# Altium schematic sheet supply.SchDoc
size A3
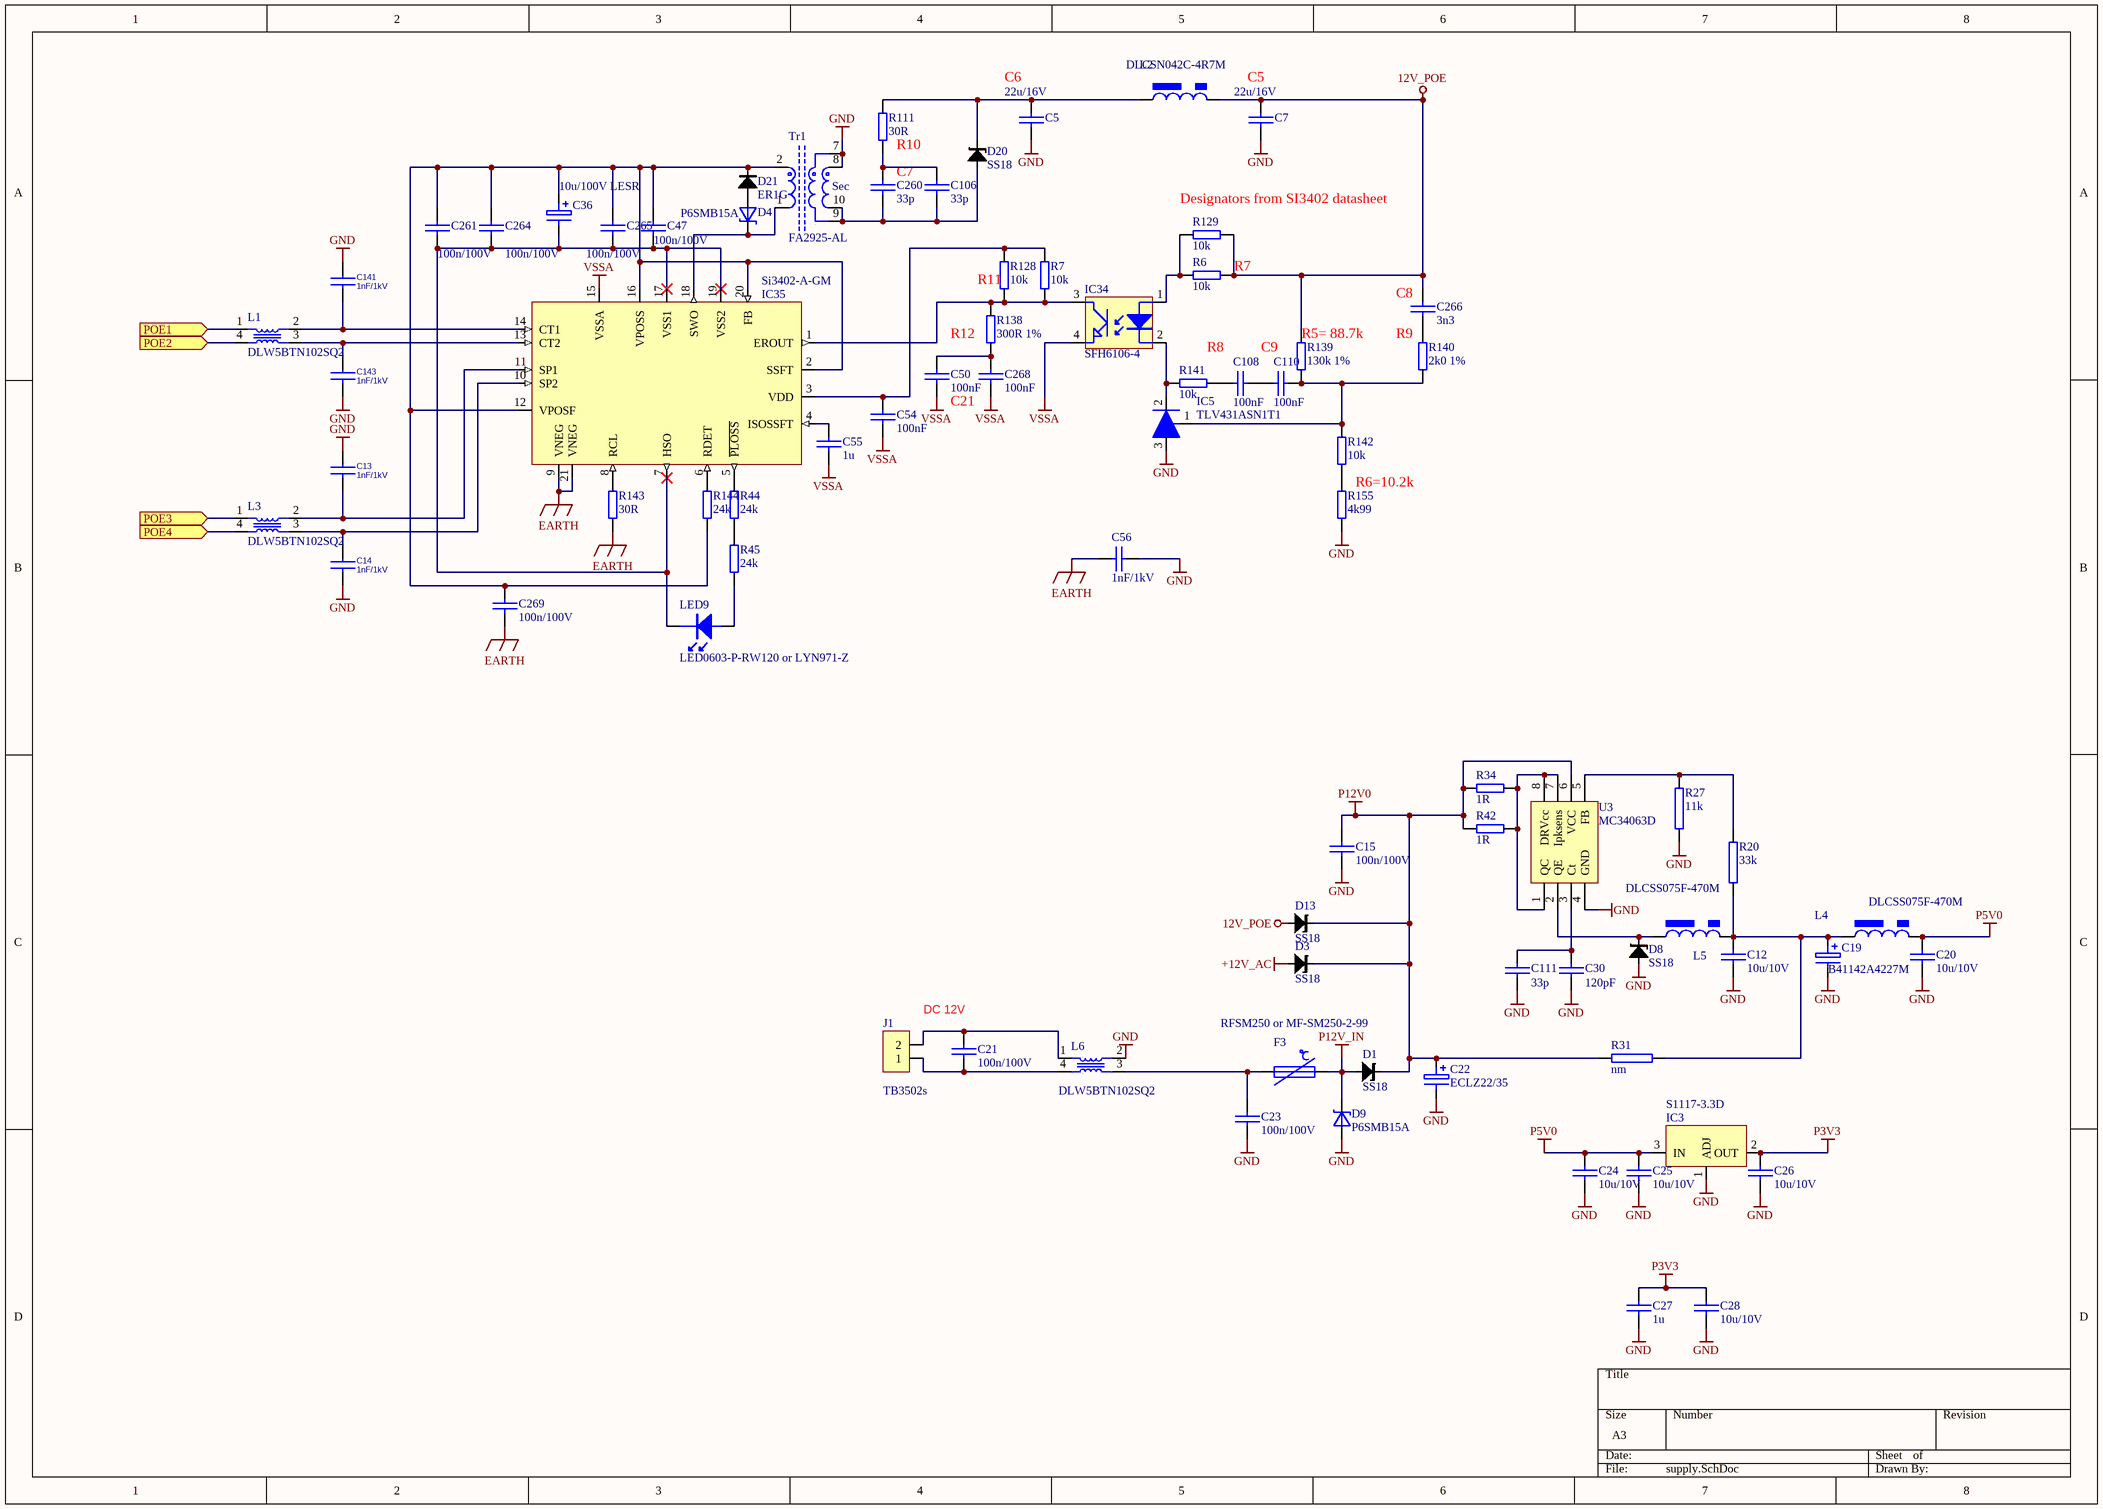
[diagram p0: supply.SchDoc]

## Parts
C5  22u/16V  [1206C]
C7  22u/16V  [1206C]
C12  10u/10V  [0805C]
C13  1nF/1kV  [1206C]
C14  1nF/1kV  [1206C]
C15  100n/100V  [0805C]
C19  B41142A4227M  [CAP_SMT_EL_5mm_C]
C20  10u/10V  [0805C]
C21  100n/100V  [0805C]
C22  ECLZ22/35  [CAP_SMT_EL_6.3mm_D]
C23  100n/100V  [0805C]
C24  10u/10V  [0805C]
C25  10u/10V  [0805C]
C26  10u/10V  [0805C]
C27  1u  [0603C]
C28  10u/10V  [0805C]
C30  120pF  [0603C]
C36  10u/100V LESR  [RB.1/.2]
C47  100n/100V  [0805C]
C50  100nF  [0402C]
C54  100nF  [0402C]
C55  1u  [0603C]
C56  1nF/1kV  [1206C]
C106  33p  [0603C]
C108  100nF  [0402C]
C110  100nF  [0402C]
C111  33p  [0603C]
C141  1nF/1kV  [1206C]
C143  1nF/1kV  [1206C]
C260  33p  [0603C]
C261  100n/100V  [0805C]
C264  100n/100V  [0805C]
C265  100n/100V  [0805C]
C266  3n3  [0603C]
C268  100nF  [0402C]
C269  100n/100V  [0805C]
D1  SS18  [DO-214AC/SMA]
D3  SS18  [DO-214AC/SMA]
D4  P6SMB15A  [DO-214AA/SMB]
D8  SS18  [DO-214AC/SMA]
D9  P6SMB15A  [DO-214AA/SMB]
D13  SS18  [DO-214AC/SMA]
D20  SS18  [DO-214AC/SMA]
D21  ER1G  [DO-214AA/SMB]
F3  RFSM250 or MF-SM250-2-99  [SMD150-2]
IC3  S1117-3.3D  [TO-252]
IC5  TLV431ASN1T1  [SOT-23]
IC34  SFH6106-4  [SOP_4]
IC35  Si3402-A-GM  [QFN20]
J1  TB3502s  [tbx3502s]
L1  DLW5BTN102SQ2  [DLW5BT]
L2  DLCSN042C-4R7M  [L_DLCSN042C]
L3  DLW5BTN102SQ2  [DLW5BT]
L4  DLCSS075F-470M  [choke_DLSD75]
L5  DLCSS075F-470M  [choke_DLSD75]
L6  DLW5BTN102SQ2  [DLW5BT]
LED9  LED0603-P-RW120 or LYN971-Z  [led_0603R]
R6  10k  [0402R]
R7  10k  [0402R]
R20  33k  [0603R]
R27  11k  [0603R]
R31  nm  [0603]
R34  1R  [0603R]
R42  1R  [0603R]
R44  24k  [0805R]
R45  24k  [0805R]
R111  30R  [0603R]
R128  10k  [0402R]
R129  10k  [0402R]
R138  300R 1%  [0603R]
R139  130k 1%  [0603R]
R140  2k0 1%  [0603R]
R141  10k  [0402R]
R142  10k  [0603R]
R143  30R  [0603R]
R144  24k  [0805R]
R155  4k99  [0603R]
Tr1  FA2925-AL  [Tr_FA2805]
U3  MC34063D  [so-8]

## Ports
POE1 (in), POE2 (in), POE3 (in), POE4 (in)

## Nets
12V_POE: C7.1 C266.2 D13.A L2.2 R6.1 R129.1 R139.2
+12V_AC: D3.A
EARTH: C56.1 C269.2 IC35.9(VNEG) IC35.21(VNEG) R143.1
GND: C5.2 C7.2 C12.2 C13.1 C14.2 C15.2 C19.2 C20.2 C22.2 C23.2 C24.2 C25.2 C26.2 C27.2 C28.2 C30.1 C56.2 C111.1 C141.1 C143.2 D8.A D9.A IC3.1(ADJ) IC5.3(A) L6.2 R27.2 R155.1 Tr1.7 Tr1.8 U3.4(GND)
P3V3: C26.1 C27.1 C28.1 IC3.2(OUT)
P5V0: C20.1 C24.1 C25.1 IC3.3(IN) L4.2
P12V0: C15.1 C22.1 D1.K D3.K D13.K R31.1 R34.1 R42.1 U3.6(VCC)
P12V_IN: D1.A D9.K F3.2
VSSA: C50.2 C54.2 C55.2 C268.2 IC34.4(E) IC35.15(VSSA)
POE1: L1.1 ; port POE1
POE2: L1.4 ; port POE2
POE3: L3.1 ; port POE3
POE4: L3.4 ; port POE4
NetC5_1: C5.1 D20.K L2.1 R111.2
NetC12_1: C12.1 C19.1 L4.1 L5.2 R20.2 R31.2
NetC13_2: C13.2 IC35.11(SP1) L3.2
NetC14_1: C14.1 IC35.10(SP2) L3.3
NetC21_1: C21.1 J1.2 L6.1
NetC21_2: C21.2 J1.1 L6.4
NetC23_1: C23.1 F3.1 L6.3
NetC30_2: C30.2 C111.2 U3.3(Ct)
NetC36_1: C36.1 C47.1 C261.1 C264.1 C265.1 C269.1 D21.K IC35.2(SSFT) IC35.12(VPOSF) IC35.16(VPOSS) IC35.20(FB) R144.1 Tr1.2
NetC36_2: C36.2 C47.2 C261.2 C264.2 C265.2 IC35.7(HSO) IC35.17(VSS1) IC35.19(VSS2) LED9.K
NetC50_1: C50.1 C268.1 R138.1
NetC54_1: C54.1 IC35.3(VDD) R7.2 R128.2
NetC55_1: C55.1 IC35.4(ISOSSFT)
NetC106_1: C106.1 C260.1 D20.A Tr1.9 Tr1.10
NetC106_2: C106.2 C260.2 R111.1
NetC108_1: C108.1 R141.1
NetC108_2: C108.2 C110.1
NetC110_2: C110.2 IC5.1(REF) R139.1 R140.1 R142.2
NetC141_2: C141.2 IC35.14(CT1) L1.2
NetC143_1: C143.1 IC35.13(CT2) L1.3
NetC266_1: C266.1 R140.2
NetD4_A: D4.A D21.A
NetD4_K: D4.K IC35.18(SWO) Tr1.1
NetD8_K: D8.K L5.1 U3.2(QE)
NetIC5_2: IC5.2(I/O) IC34.2(K) R141.2
NetIC34_1: IC34.1(A) R6.2 R129.2
NetIC34_3: IC34.3(C) IC35.1(EROUT) R7.1 R128.1 R138.2
NetIC35_5: IC35.5(~{PLOSS}) R44.2
NetIC35_6: IC35.6(RDET) R144.2
NetIC35_8: IC35.8(RCL) R143.2
NetLED9_A: LED9.A R45.1
NetR20_1: R20.1 R27.1 U3.5(FB)
NetR34_2: R34.2 R42.2 U3.1(QC) U3.7(Ipksens) U3.8(DRVcc)
NetR44_1: R44.1 R45.2
NetR142_1: R142.1 R155.2

## Notes on the sheet
- (near C5) C6
- C5
- (near C260) C7
- (near R111) R10
- (near R129) Designators from SI3402 datasheet
- (near R128) R11
- (near R6) R7
- (near C266) C8
- R12
- R8
- C9
- (near R139) R5= 88.7k
- R9
- C21
- R6=10.2k
- DC 12V
- (in symbol Tr_FAFA2925) Sec

## Library data of the parts
C5 C7 C56 = CAP_SMD_1206: Capacitor SMD; Supplier 1: Newark; Supplier Part Number 1: 90R7810
C12 C15 C20 C21 C23-C26 C28 C47 C261 C264 C265 C269 = CAP_SMD_0805: Capacitor SMD; Supplier 1: Farnell; Supplier Part Number 1: 1833812
C13 C14 C141 C143 = X7R,1000pF,2KV,1206_0: CAP,X7R,1000P,2KV,10%; Part number: 320001600G; Specification: 1206,ROHS; TYPE: CAPACITOR; Vivotek P/N: ?
C19 = CAP_ELECTRO_SMD_C: Electrolytic Capacitor
C22 = CAP_ELECTRO_SMD_D: Electrolytic Capacitor; Supplier 1: Farnell; Supplier Part Number 1: 1698664
C27 C55 C106 C260 C266 = CAP_SMD_0603: Capacitor SMD; Supplier 1: Digi-Key; Supplier Part Number 1: 490-1524-2-ND
C30 C111 = CAP_SMD: Capacitor SMD
C36 = CAP_ELECTRO_5mm: Electrolytic Capacitor; Supplier 1: Newark; Supplier Part Number 1: 55T0367
C50 C54 C108 C110 C268 = CAP_SMD_0402: Capacitor SMD; Supplier 1: Newark; Supplier Part Number 1: 14T3275
D1 D3 D8 D13 D20 = shottky_SS14_18: shottky diode (Maritex)
D4 D9 = D_TVS_33V_SMD_0.6KW_uni: transil 600W; Supplier 1: Farnell; Supplier Part Number 1: 1578879
D21 = D_ER1G: 1A, 400V, 35ns
F3 = F_PTC_9.5x6mm: 2.50A/15V; Supplier 1: Newark; Supplier Part Number 1: 61J7435
IC3 = REG_S1117-3.3D: Voltage Regulator
IC5 = REF_TLV431_SOT23_16V: 16V 1.24V ADJ Voltage reference; Supplier 1: Newark; Supplier Part Number 1: 31K7719
IC34 = OPTO-SFH6106-4: opto-coupler; Supplier 1: Newark; Supplier Part Number 1: 58K2193
IC35 = PM_Si3402: POE PD INTERFACE; Supplier 1: Digi-Key; Supplier Part Number 1: SI3402-A-GMR-ND
J1 = CON_TB2: Terminal Block
L1 L3 L6 = L_CMC_DLW5BT: CMC, 2A, 100R, 50V; Supplier 1: Digi-Key; Supplier Part Number 1: 490-4018-1-ND
L2 = L_POWER_DLCSN042C_1uH: 1uH, 2.9A, 0.07R, inductor (Maritex); Supplier 1: Newark; Supplier Part Number 1: 74R9551
L4 L5 = L_POWER_INDUCTOR_CSS075F: inductor
LED9 = LED_0603R: LED 0603 red; Supplier 1: Newark; Supplier Part Number 1: 22M3004
R6 R7 R128 R129 R141 = RES_0402: SMD Resistor; Supplier 1: Newark; Supplier Part Number 1: 59M6691
R20 R27 R31 = RES_SMD: SMD Resistor
R34 R42 R111 R138-R140 R142 R143 R155 = RES_0603: SMD Resistor; Supplier 1: Newark; Supplier Part Number 1: 39K0073
R44 R45 R144 = RES_0805: SMD Resistor; Supplier 1: Newark; Supplier Part Number 1: 05F1507
Tr1 = Tr_FAFA2925: 15W, 12V PoE Transformer, for Si3402, Coilcraft only; Supplier 1: Newark; Supplier Part Number 1: 13T9829
U3 = MC34063A